# Altium schematic sheet Teensy_and_ICs.SchDoc
size A3; SheetNumber: 1; SheetTotal: 2; ENG_APP_DATE: --/--/--; DSN_APP_DATE: --/--/--; CHK_APP_DATE: --/--/--
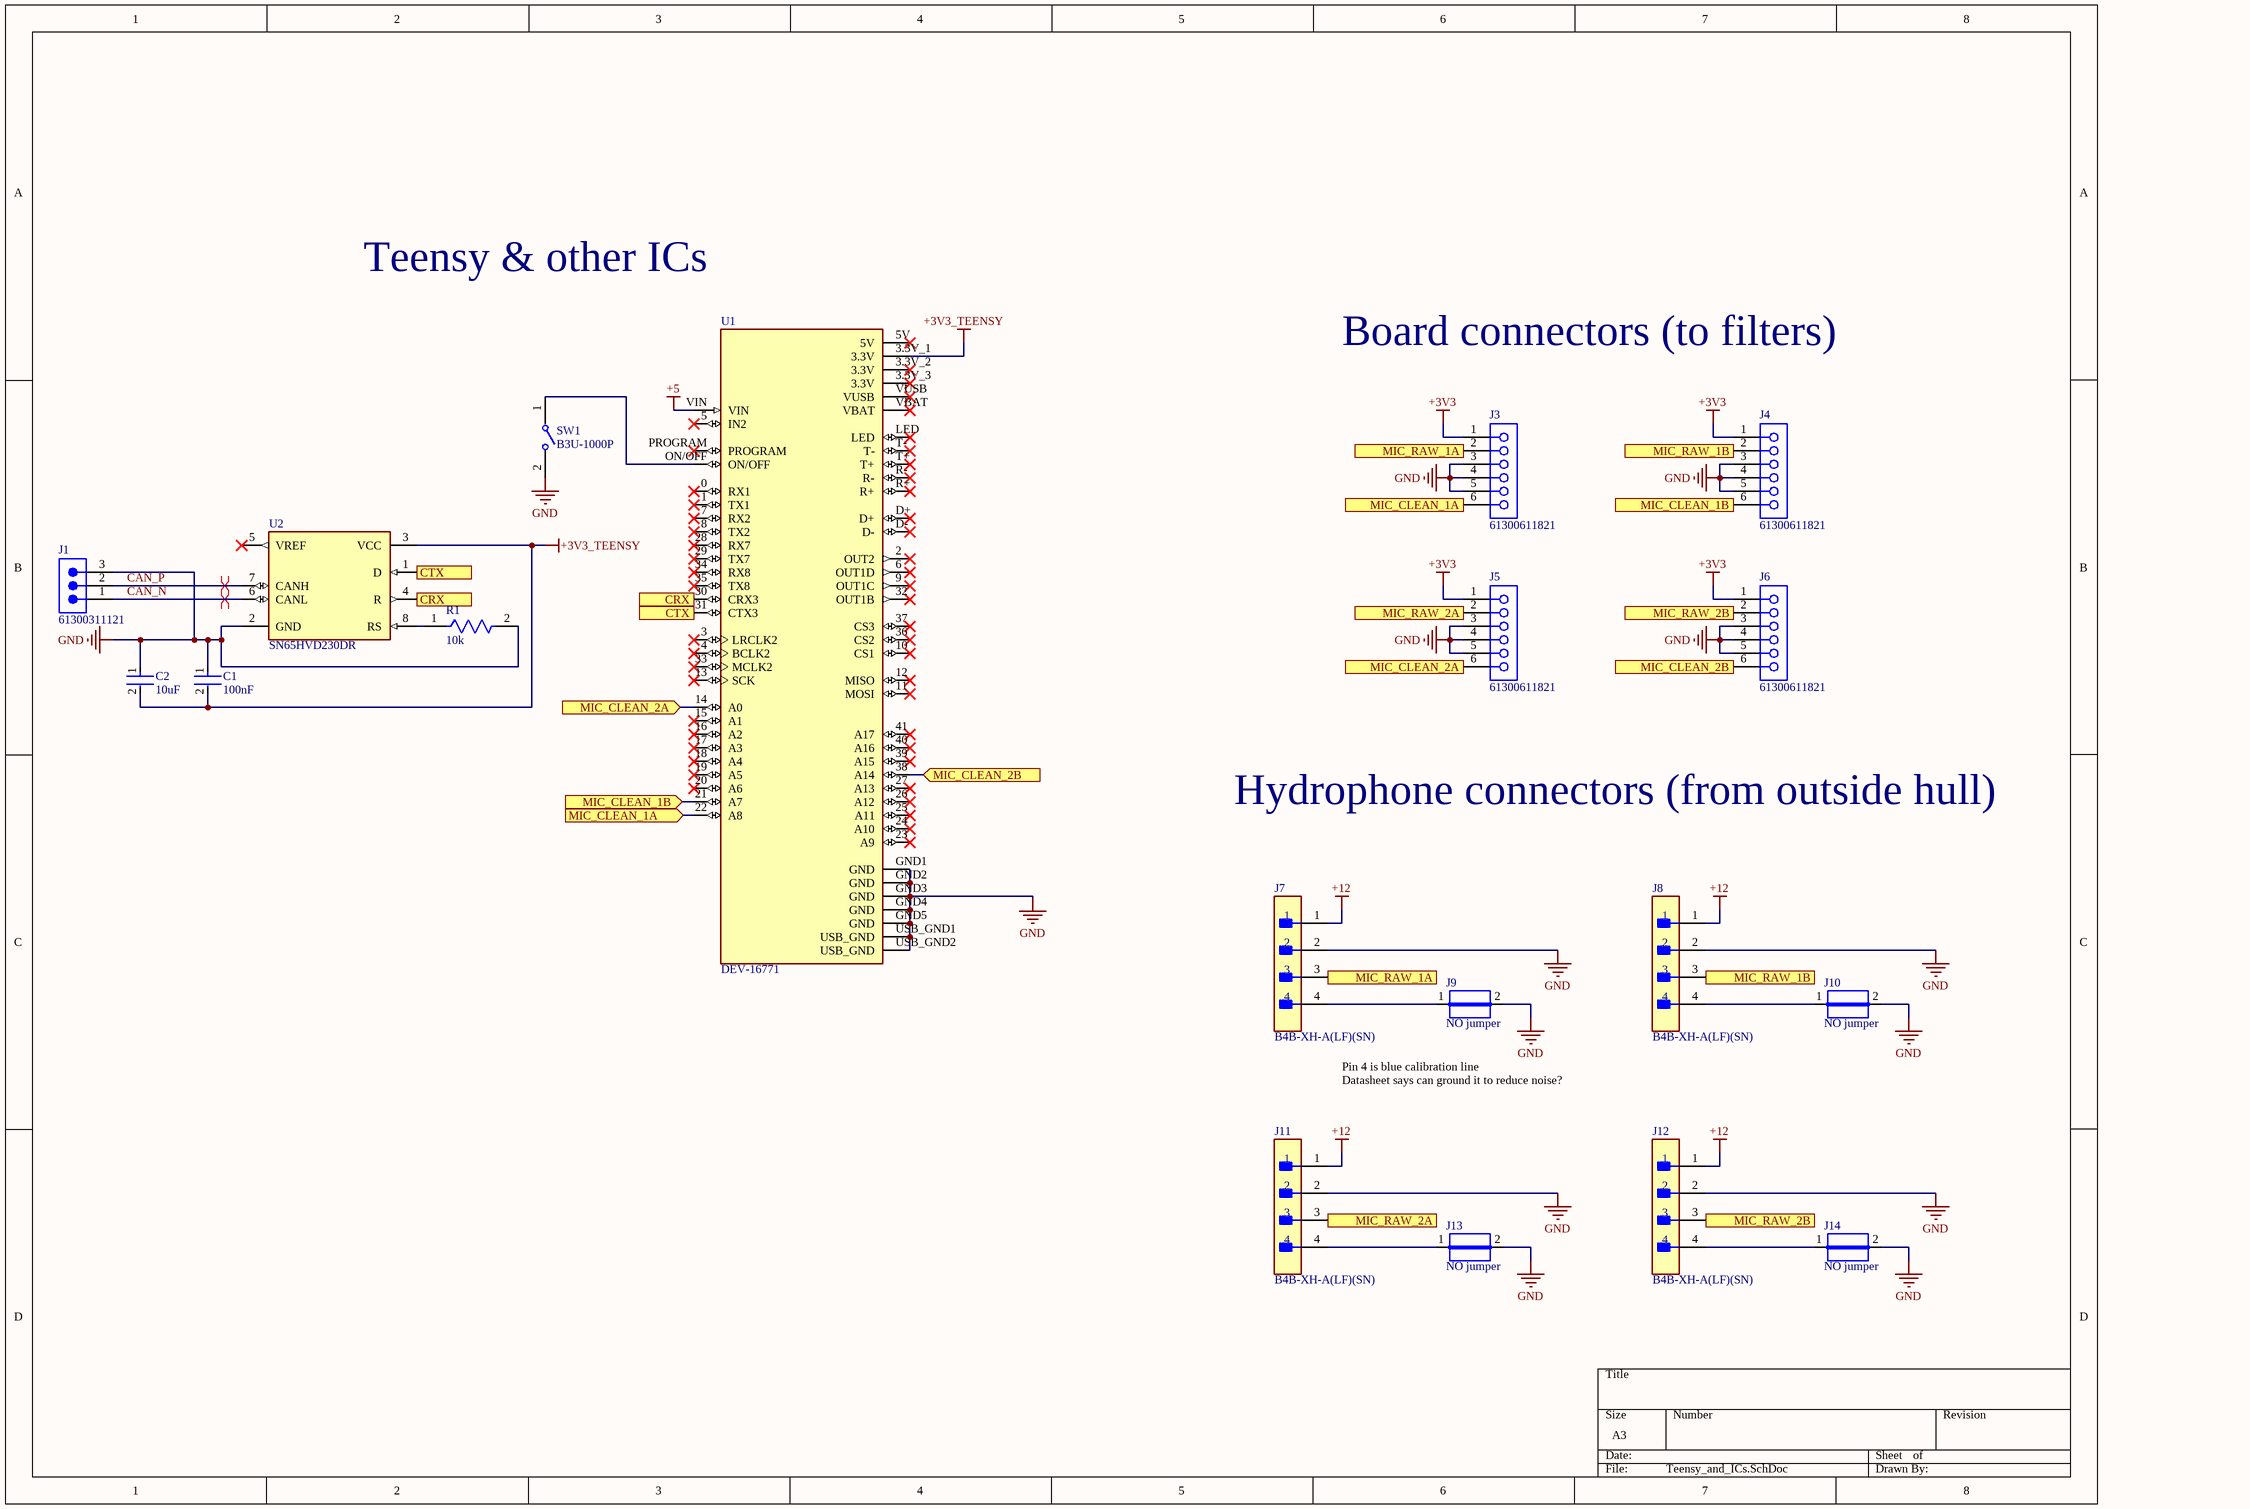
[diagram p0: Teensy_and_ICs.SchDoc]

## Parts
C1  100nF  [FP-GCM188-0_1-IPC_A]
C2  10uF  [FP-GCM188-0_1-IPC_A]
J1  61300311121  [61300311121]
J3  61300611821  [61300611821]
J4  61300611821  [61300611821]
J5  61300611821  [61300611821]
J6  61300611821  [61300611821]
J7  B4B-XH-A(LF)(SN)  [FP-B4B-XH-A_LF_SN-MFG]
J8  B4B-XH-A(LF)(SN)  [FP-B4B-XH-A_LF_SN-MFG]
J9  NO jumper  [JUMPER]
J10  NO jumper  [JUMPER]
J11  B4B-XH-A(LF)(SN)  [FP-B4B-XH-A_LF_SN-MFG]
J12  B4B-XH-A(LF)(SN)  [FP-B4B-XH-A_LF_SN-MFG]
J13  NO jumper  [JUMPER]
J14  NO jumper  [JUMPER]
R1  10k  [FP-RT0603-IPC_A]
SW1  B3U-1000P  [FP-B3U-1000P-MFG]
U1  DEV-16771  [DEV-16771-Footprint-1]
U2  SN65HVD230DR  [FP-D0008A-IPC_B]

## Ports
CRX (in, see Teensy_and_ICs[7C]), CRX (out, see Teensy_and_ICs[6C]), CTX (in, see Teensy_and_ICs[6C]), CTX (out, see Teensy_and_ICs[7C]), MIC_CLEAN_1A (in, see Teensy_and_ICs[3C]), MIC_CLEAN_1A (out, see Teensy_and_ICs[6B]), MIC_CLEAN_1B (in, see Teensy_and_ICs[2C]), MIC_CLEAN_1B (out, see Teensy_and_ICs[6B]), MIC_CLEAN_2A (in, see Teensy_and_ICs[3C]), MIC_CLEAN_2A (out, see Teensy_and_ICs[6C]), MIC_CLEAN_2B (in, see Teensy_and_ICs[2C]), MIC_CLEAN_2B (out, see Teensy_and_ICs[5B]), MIC_RAW_1A (in, see Teensy_and_ICs[3B]), MIC_RAW_1A (out, see Teensy_and_ICs[3C]), MIC_RAW_1B (in, see Teensy_and_ICs[2B]), MIC_RAW_1B (out, see Teensy_and_ICs[2C]), MIC_RAW_2A (in, see Teensy_and_ICs[3A]), MIC_RAW_2A (out, see Teensy_and_ICs[3C]), MIC_RAW_2B (in, see Teensy_and_ICs[2A]), MIC_RAW_2B (out, see Teensy_and_ICs[2C])

## Nets
+3V3: J3.1 J4.1 J5.1 J6.1
+3V3_TEENSY: C1.2 C2.2 U1.3.3V_1(3.3V) U2.3(VCC)
+5: U1.VIN
+12: J7.1 J8.1 J11.1 J12.1
GND: C1.1 C2.1 J1.3 J3.3 J3.4 J3.5 J4.3 J4.4 J4.5 J5.3 J5.4 J5.5 J6.3 J6.4 J6.5 J7.2 J8.2 J9.2 J10.2 J11.2 J12.2 J13.2 J14.2 R1.2 SW1.2 U1.GND1(GND) U1.GND2(GND) U1.GND3(GND) U1.GND4(GND) U1.GND5(GND) U1.USB_GND1(USB_GND) U1.USB_GND2(USB_GND) U2.2(GND)
CAN_N: J1.1 U2.6(CANL)
CAN_P: J1.2 U2.7(CANH)
CRX: U1.30(CRX3) U2.4(R) ; port CRX
CTX: U1.31(CTX3) U2.1(D) ; port CTX
MIC_CLEAN_1A: J3.6 U1.22(A8) ; port MIC_CLEAN_1A
MIC_CLEAN_1B: J4.6 U1.21(A7) ; port MIC_CLEAN_1B
MIC_CLEAN_2A: J5.6 U1.14(A0) ; port MIC_CLEAN_2A
MIC_CLEAN_2B: J6.6 U1.38(A14) ; port MIC_CLEAN_2B
MIC_RAW_1A: J3.2 J7.3 ; port MIC_RAW_1A
MIC_RAW_1B: J4.2 J8.3 ; port MIC_RAW_1B
MIC_RAW_2A: J5.2 J11.3 ; port MIC_RAW_2A
MIC_RAW_2B: J6.2 J12.3 ; port MIC_RAW_2B
NetJ7_4: J7.4 J9.1
NetJ8_4: J8.4 J10.1
NetJ11_4: J11.4 J13.1
NetJ12_4: J12.4 J14.1
NetR1_1: R1.1 U2.8(RS)
NetSW1_1: SW1.1 U1.ON/OFF

Not connected (* = marked no-connect by the designer): U1 0(RX1)* 1(TX1)* 2(OUT2)* 3(LRCLK2)* 3.3V_2(3.3V)* 3.3V_3(3.3V)* 4(BCLK2)* 5(IN2)* 5V* 6(OUT1D)* 7(RX2)* 8(TX2)* 9(OUT1C)* 10(CS1)* 11(MOSI)* 12(MISO)* 13(SCK)* 15(A1)* 16(A2)* 17(A3)* 18(A4)* 19(A5)* 20(A6)* 23(A9)* 24(A10)* 25(A11)* 26(A12)* 27(A13)* 28(RX7)* 29(TX7)* 32(OUT1B)* 33(MCLK2)* 34(RX8)* 35(TX8)* 36(CS2)* 37(CS3)* 39(A15)* 40(A16)* 41(A17)* D+* D-* LED* PROGRAM* R+* R-* T+* T-* VBAT* VUSB*; U2 5(VREF)*

## Layout directives
differential pair: CAN_N, CAN_P

## Notes on the sheet
- Teensy & other ICs
- Board connectors (to filters)
- Hydrophone connectors (from outside hull)
- Pin 4 is blue calibration line
  Datasheet says can ground it to reduce noise?
- DWG. NO.
- REV.
- SHT.
- THIS DOCUMENT AND THE DATA DISCLOSED HEREIN OR HEREWITH IS THE PROPERTY OF ALTIUM LIMITED AND MAY BE FREELY DISTRIBUTED IN WHOLE. NO RIGHTS ARE RESERVED OR EXPRESS OR IMPLIED WARANTEE GIVEN.
- REVISION
- DESCRIPTION
- DATE
- APPROVED
- ENG:
- APPROVALS
- PROJECT
- DSN:
- CHK:
- REFERENCE DOCUMENTS
- PROJECT REVISION:
- TITLE
- DOCUMENT REVISION:
- DESIGN ITEM:
- BOM:
- FAB DWG:
- PCB DWG:
- ASSY DWG:
- SCALE:
- SIZE
- B
- CAGE CODE
- FILE NAME
- DWG NO.
- SHEET
- OF
- REV

## Library data of the parts
C1 = CMP-00033-2: 50V 100nF Ceramic Capacitor, Multilayer, Ceramic, 50V, 10% +Tol, 10% -Tol, X7R, 15% TC, 0.1uF, Surface Mount, 0603; Multilayer: Yes; Max Operating Temperature: 125°C; Tolerance (fill in as +-): 10%; Packaging: Tape and Reel; Min Operating Temperature: -55°C; Package Style: SMTMeter; Termination: Wraparound; Pins: 2; Dielectric Material: Ceramic; Temperature Characteristics Code: X7R; JESD-609 Code: e3; Width: 0.8mm; Rated DC Voltage (URdc): 50V; Package Shape: Rectangular; Case/Package: 0603; Length: 1.6mm; Height: 0.8mm; Reach SVHC Compliant: Yes; Value: 100nF; Capacitor Type: Ceramic; Tolerance  (fill in as +-): 10%; Terminal Finish: Nickel; Mounting Technology: Surface Mount; RoHS Compliant: Yes
C2 = CMP-00036-2: 25V 10uF Ceramic Capacitor, Multilayer, Ceramic, 25V, 10% +Tol, 10% -Tol, X5R, 15% TC, 10uF, Surface Mount, 0603; Multilayer: Yes; Max Operating Temperature: 85°C; Termination: Wraparound; Tolerance  (fill in as +-): 10%; Case/Package: 0603; Terminal Finish: Nickel; Pins: 2; Packaging: Tape and Reel; Temperature Characteristics Code: X5R; Value: 10uF; JESD-609 Code: e3; Mounting Technology: Surface Mount; Reach SVHC Compliant: Yes; Min Operating Temperature: -55°C; RoHS Compliant: Yes; Package Shape: Rectangular; Tolerance (fill in as +-): 10%; Capacitor Type: Ceramic; Dielectric Material: Ceramic; Rated DC Voltage (URdc): 25V
J1 = CMP-00056-1: Board Connector, 3 Contact(s), 1 Row(s), Male, Straight, 0.1 inch Pitch, Solder Terminal, Locking, Black Insulator, Plug (inverted 3D model); Reliability: COMMERCIAL; Dielectric Withstanding Voltage (AC): 500V; Contact Style: SQ PIN-SKT; PCB Contact Pattern: RECTANGULAR; Body Length: 0.3inch; Number of Rows Loaded: 1; Number of Contacts: 3; Reference Standard: UL; Contact Resistance: 20mR; Rated Current (Signal): 3A; Insulation Resistance: 1GR; Contact Gender: Male; Body Breadth: 0.1inch; Reach SVHC Compliant: Yes; Contact Finish - Mating: GOLD; Contact Finish - Termination: Gold (Au) - with Nickel (Ni) barrier; Terminal Length: 0.118inch; Contact Pattern: RECTANGULAR; Body/Shell Style: PLUG; Insulation Color: Black; Mounting Option 1: LOCKING; JESD-609 Code: e4; Terminal Pitch: 2.54mm; Connector Type: BOARD CONNECTOR; RoHS Compliant: Yes; Mounting Style: STRAIGHT; Body Depth: 0.1inch; Contact Material: Copper Alloy; Max Operating Temperature: 125°C; Mating Contact Pitch: 0.1inch; Mounting Technology: Board; Termination: Solder; Number Of Connectors: 1; Min Operating Temperature: -40°C; Insulation Material: Polybutylene; System: Connector
J3-J6 = CMP-00042-1: 6P Single Row 2.54mm Wurth Elektronik Female Header Pin; Manufacturer Series: 613; Number Of Connectors: 1; PCB Contact Pattern: RECTANGULAR; Contact Style: SQ PIN-SKT; Reliability: COMMERCIAL; Rated Current (Signal): 3A; Reference Standard: UL; Body/Shell Style: PLUG; Body Breadth: 0.1inch; Number of Contacts: 6; Dielectric Withstanding Voltage (AC): 500V; Connector Type: BOARD CONNECTOR; Mounting Option 1: LOCKING; Insulation Resistance: 1GR; Contact Resistance: 20mR; Body Depth: 0.335inch; Body Length: 0.6inch; System: Connector; Contact Gender: Male; Insulation Color: Black; Contact Pattern: RECTANGULAR; Termination: Solder; Insulation Material: Polybutylene; Min Operating Temperature: -40°C; Mounting Style: STRAIGHT; Contact Material: Copper Alloy; Number of Rows Loaded: 1; Terminal Length: 0.118inch; Contact Finish - Termination: GOLD; RoHS Compliant: Yes; Reach SVHC Compliant: Yes; Contact Finish - Mating: GOLD; Max Operating Temperature: 125°C; Terminal Pitch: 2.54mm; JESD-609 Code: e4; Mounting Technology: Board; Mating Contact Pitch: 0.1inch
J7 J8 J11 J12 = CMP-00038-1: Header for PCB; pitch 2.50mm; 4-contacts; THT male; top entry; 250V/3A; System: Connector
J9 J10 J13 J14 = CMP-009-00183-2: Normally-Open SMD jumper pads; Pins: 2
R1 = CMP-00035-1: 10k 1% Fixed Resistor, Metal Glaze/thick Film, 0.1W, 10000ohm, 75V, 1% +/-Tol, 100ppm/Cel, Surface Mount, 0603; Power: 100mW; Temperature Coefficient (ppm/Cel): 100; Package Height: 0.45mm; Package Length: 1.6mm; Additional Feature: LASER TRIMMABLE; Package Width: 0.8mm; Value: 10kR; Rated Temperature: 70°C; Construction: Chip; Resistor Type: FIXED RESISTOR; Terminal Finish: Nickel; Mounting Technology: Surface Mount; Technology: METAL GLAZE/THICK FILM; Min Operating Temperature: -55°C; Pins: 2; Termination: Wraparound; Working Voltage: 75V; RoHS Compliant: Yes; Packaging: Tape and Reel; Case/Package: 0603; JESD-609 Code: e3; Package Shape: Rectangular; Reach SVHC Compliant: Yes; Max Operating Temperature: 155°C; Tolerance: 1%
SW1 = CMP-00054-2: Switch Tactile N.O. SPST Round Button Solder Tab 12VDC 200000Cycles 1.5N SMD Emboss T/R; Current Rating: 50mA; Number of Positions: 2; Switch Function: Off-Mom; Max Voltage Rating (DC): 12V; Insulation Resistance: 100MR; Illumination Type: Non-Illuminated,Illuminated; Ratings: Dust Proof,IP40; Actuator Length: 0.4mm; Actuator Type: Standard; Switch Travel: 0.15mm; Throw Configuration: SPST; Packaging: Tape and Reel; Package Quantity: 1; Weight: 0.000776oz; Depth: 2.5mm; Series: B3U; Orientation: Straight; Max Current Rating: 50mA; Voltage Rating (DC): 12V; Length: 4mm; Electrical Life: 200000Cycles; Contact Material: Silver; Color: Silver; Width: 3mm; RoHS Compliant: Yes; Contact Resistance: 100mR; Lead Free: Lead Free; Operating Force: 1.5N; Height: 1.2mm; Pins: 2; Mounting Technology: Surface Mount; Contact Current Rating: 50mA; Reach SVHC Compliant: Unknown; Max Operating Temperature: 70°C; Mechanical Life: 200000Cycles; Min Operating Temperature: -25°C; Termination: SMD/SMT
U1 = CMP-003-000000-7: RT1062 Teensy 4.1 series ARM® Cortex®-M7 MPU Embedded Evaluation Board; MF: SparkFun Electronics; Package: None; MP: DEV-16771; Check_prices: https://www.snapeda.com/parts/DEV-16771/SparkFun+Electronics/view-part/?ref=eda; Value: *; SnapEDA_Link: https://www.snapeda.com/parts/DEV-16771/SparkFun+Electronics/view-part/?ref=snap; Design Item ID: DEV-16771; Component Type: Standard; Source: DEV-16771.SchLib; Pin Count: 65
U2 = CMP-00055-1: Interface Circuit, 1-Trnsvr, BICMOS, PDSO8; Nominal Supply Voltage: 3.3V; Package Equivalence Code: SOP8,.25; Data Rate: 1000Mbps; Number of Transceivers: 1; Qualification Status: Not Qualified; Max Supply Current: 17uA; Package Body Material: Plastic; Length: 4.9mm; Terminal Form: Gull Wing; Terminal Pitch: 1.27mm; Max Operating Temperature: 85°C; Terminal Finish: Nickel; Height - Seated (Max): 1.75mm; JESD-609 Code: e4; Case/Package: SOP; Telecom IC Type: INTERFACE CIRCUIT; Surface Mount: Yes; Moisture Sensitivity Level: 1; Temperature Grade: INDUSTRIAL; Channels: 1; Reach SVHC Compliant: Yes; Package Style: SMALL OUTLINEMeter; Package Shape: Rectangular; Terminal Position: DUAL; RoHS Compliant: Yes; Technology: BICMOS; Power Supplies: 3.3V; Width: 3.9mm; JESD-30 Code: R-PDSO-G8; Peak Reflow Temperature (Cel): 260°C; Pins: 8; Min Operating Temperature: -40°C